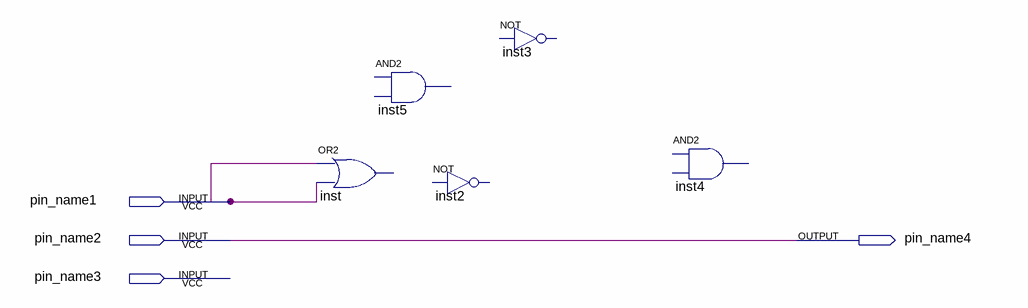
[diagram p0: schematic sheet]
// Quartus schematic Lab1.bdf as structural Verilog: 5 symbols, 4 pins
module Lab1 (
  input  pin_name1,
  input  pin_name2,
  input  pin_name3,
  output pin_name4
);

  // AND2 inst5 is placed but not wired
  // OR2 inst has open pins: IN1=pin_name1, IN2=pin_name1, OUT=open
  // NOT inst2 is placed but not wired
  // NOT inst3 is placed but not wired
  // AND2 inst4 is placed but not wired

  assign pin_name4 = pin_name2;
endmodule
